# Altium project SAS_Adaper.PrjPcb
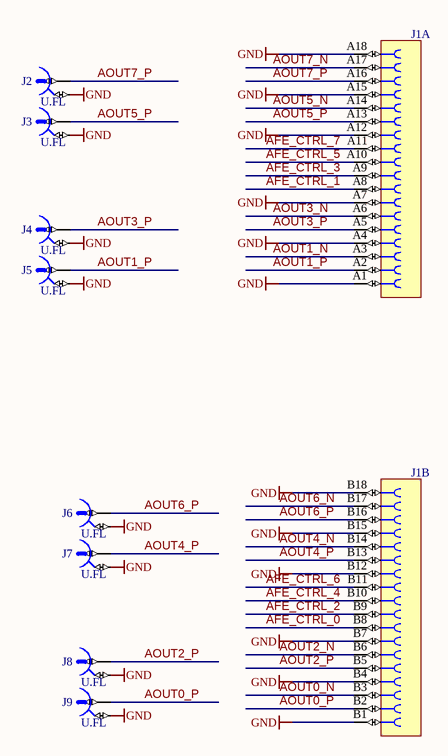
[diagram p0: SAS_UFL_Adapter.SchDoc]
1 sheet, 9 parts. Net scope: global (net labels, ports and power ports of the same name join across sheets).
Board file: SAS_UFL_Adapter.PcbDoc

## Sheet SAS_UFL_Adapter.SchDoc
size A4; SheetNumber: 1; SheetTotal: 1

### Parts
J1  mini-SAS  [mini_SAS_PCB_EDGE]  (value not drawn)  (parts A,B of 2)  (no BOM)
J2  U.FL  [HIROSE_U.FL-R-SMT-1(10)]
J3  U.FL  [HIROSE_U.FL-R-SMT-1(10)]
J4  U.FL  [HIROSE_U.FL-R-SMT-1(10)]
J5  U.FL  [HIROSE_U.FL-R-SMT-1(10)]
J6  U.FL  [HIROSE_U.FL-R-SMT-1(10)]
J7  U.FL  [HIROSE_U.FL-R-SMT-1(10)]
J8  U.FL  [HIROSE_U.FL-R-SMT-1(10)]
J9  U.FL  [HIROSE_U.FL-R-SMT-1(10)]

### Nets
GND: J1.A1 J1.A4 J1.A7 J1.A12 J1.A15 J1.A18 J1.B1 J1.B4 J1.B7 J1.B12 J1.B15 J1.B18 J2.2 J3.2 J4.2 J5.2 J6.2 J7.2 J8.2 J9.2
AFE_CTRL_0: J1.B8
AFE_CTRL_1: J1.A8
AFE_CTRL_2: J1.B9
AFE_CTRL_3: J1.A9
AFE_CTRL_4: J1.B10
AFE_CTRL_5: J1.A10
AFE_CTRL_6: J1.B11
AFE_CTRL_7: J1.A11
AOUT0_N: J1.B3
AOUT0_P: J1.B2 J9.1
AOUT1_N: J1.A3
AOUT1_P: J1.A2 J5.1
AOUT2_N: J1.B6
AOUT2_P: J1.B5 J8.1
AOUT3_N: J1.A6
AOUT3_P: J1.A5 J4.1
AOUT4_N: J1.B14
AOUT4_P: J1.B13 J7.1
AOUT5_N: J1.A14
AOUT5_P: J1.A13 J3.1
AOUT6_N: J1.B17
AOUT6_P: J1.B16 J6.1
AOUT7_N: J1.A17
AOUT7_P: J1.A16 J2.1

### Library data of the parts
J1 = CON_mini_SAS_PCB_EDGE: 36 Position mini-SAS PCB Edge Connector 36 (2x18); Manufacturer Part Number: gold fingers; Mounted: No; PressFit: No; Part Number: mini_SAS_PCB_EDGE; Component Type: Standard; Pin Count: 36; Family: mini-SAS; Socket: No; SMD: Yes; Sense: No; Status: None; Part Description: 36 Position mini-SAS PCB Edge Connector 36 (2x18); Manufacturer: PCB; ComponentHeight: 0; HelpURL: \\cern.ch\dfs\Applications\Altium\Datasheets\MOLEX_75783-0107.pdf; Author: GK; CreateDate: 12.11.2014; LatestRevisionDate: 12.11.2014
J2-J9 = HIROSE_U.FL-R-SMT-1(10): Part Description: Up to 6GHz Ultra Small Surface Mount Male Coaxial Connectors U.FL Series; Manufacturer: HIROSE (HRS); PressFit: No; Part Number: HIROSE_U.FL-R-SMT-1(10); Component Kind: Standard; Component Type: Standard; Pin Count: 2; Family: U.FL; Mounted: Yes; Socket: No; SMD: Yes; Sense: No; Status: None; Manufacturer Part Number: U.FL-R-SMT-1(10); ComponentHeight: 1.25mm; HelpURL: \\cern.ch\dfs\Applications\Altium\Datasheets\HIROSE_U.FL-R-SMT-1(10).pdf; Author: CERN DEM JLC; CreateDate: 24.03.2010; LatestRevisionDate: 24.03.2010